# Altium schematic sheet Main_Schematic.SchDoc
size A3; SheetNumber: 1; SheetTotal: 2; SPICEModelCacheWWVJURST: <root> / <DocumentId>WWVJURST</DocumentId> / </root>
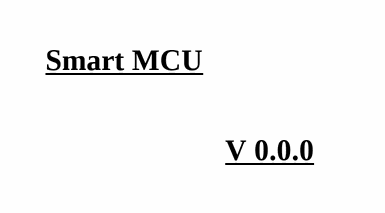
[diagram p0: Main_Schematic.SchDoc]

## Notes on the sheet
- Smart MCU
- V 0.0.0